# Altium project middlePCB_rev4.PrjPcb
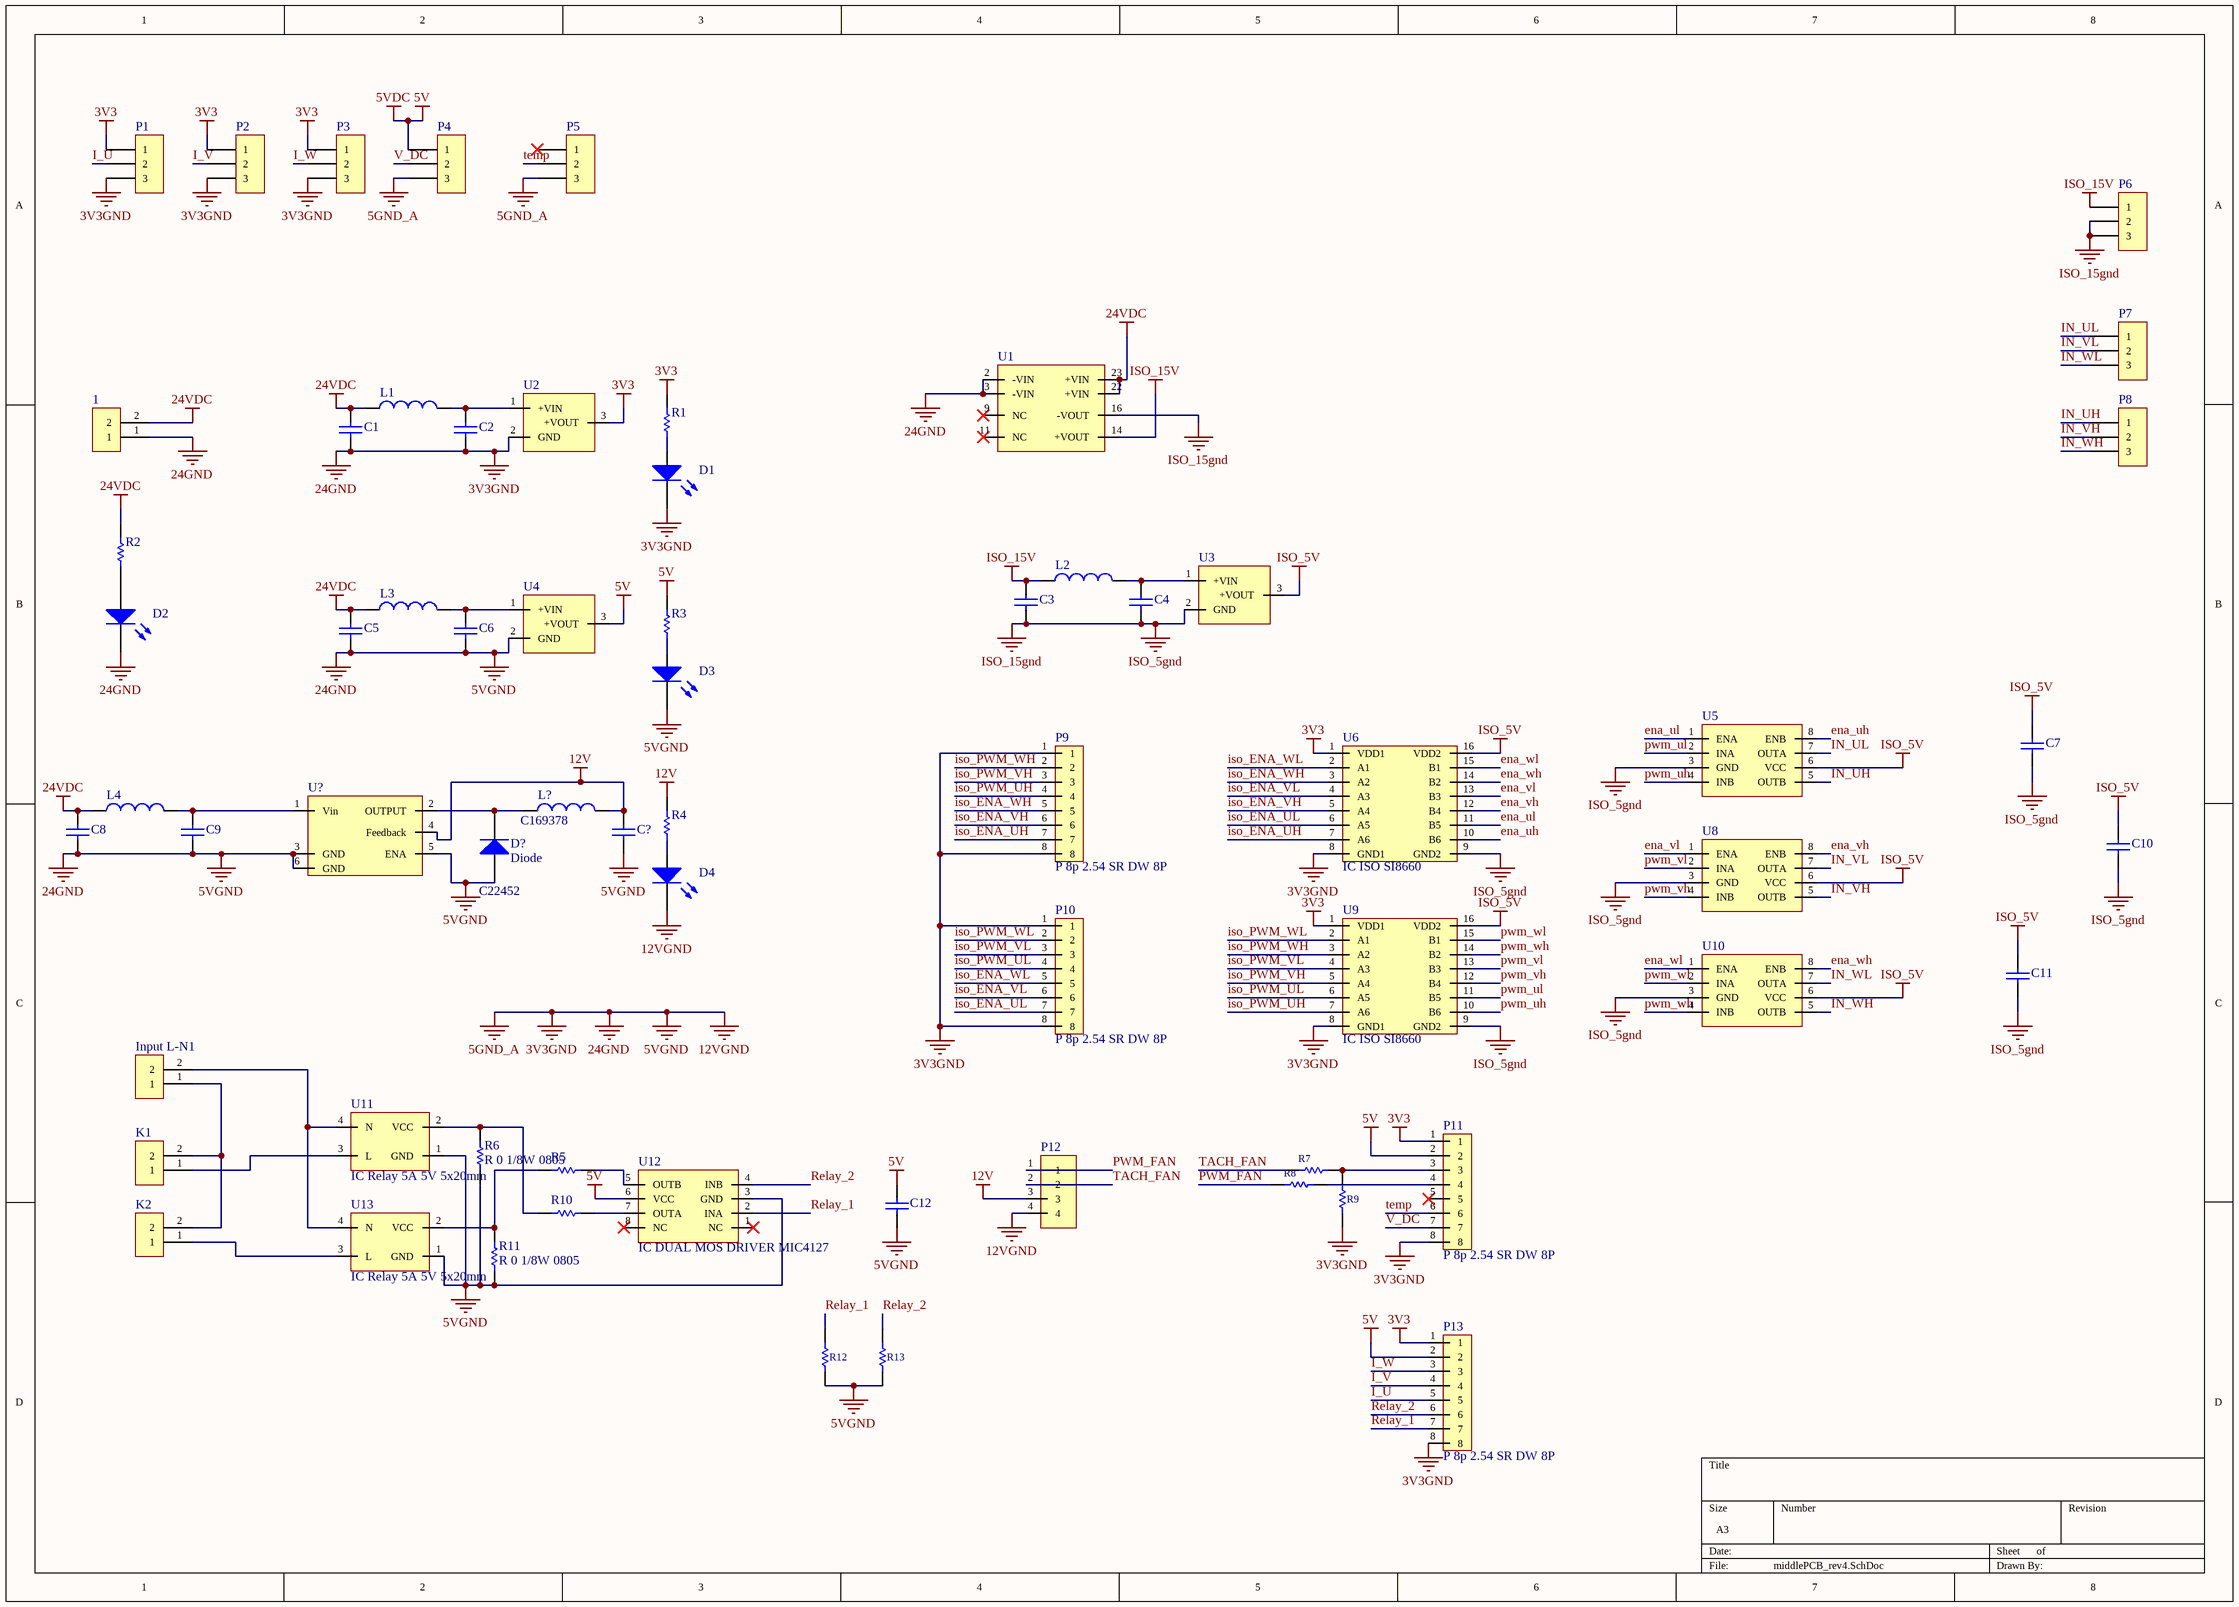
[diagram p0: middlePCB_rev4.SchDoc]
1 sheet, 66 parts. Net scope: global (net labels, ports and power ports of the same name join across sheets).
Board file: middlePCB_rev4.PcbDoc

## Sheet middlePCB_rev4.SchDoc
size A3

### Parts
1  P 2p 5mm  [connector1x2_parafuso]  (value not drawn)
C1  C 10uF 1206 MLCC 50V X5R  [CAPC_1206]  (value not drawn)
C2  C 10uF 1206 MLCC 50V X5R  [CAPC_1206]  (value not drawn)
C3  C 10uF 1206 MLCC 50V X5R  [CAPC_1206]  (value not drawn)
C4  C 10uF 1206 MLCC 50V X5R  [CAPC_1206]  (value not drawn)
C5  C 10uF 1206 MLCC 50V X5R  [CAPC_1206]  (value not drawn)
C6  C 10uF 1206 MLCC 50V X5R  [CAPC_1206]  (value not drawn)
C7  C 10uF 1206 MLCC 50V X5R  [CAPC_1206]  (value not drawn)
C8  C 10uF 1206 MLCC 50V X5R  [CAPC_1206]  (value not drawn)
C9  C 10uF 1206 MLCC 50V X5R  [CAPC_1206]  (value not drawn)
C10  C 10uF 1206 MLCC 50V X5R  [CAPC_1206]  (value not drawn)
C11  C 10uF 1206 MLCC 50V X5R  [CAPC_1206]  (value not drawn)
C12  C 10uF 1206 MLCC 50V X5R  [CAPC_1206]  (value not drawn)
C?  C 10uF 1206 MLCC 50V X5R  [CAPC_1206]  (value not drawn)
D1  IC LED 1206  [DIODE_1206]  (value not drawn)
D2  IC LED 1206  [DIODE_1206]  (value not drawn)
D3  IC LED 1206  [DIODE_1206]  (value not drawn)
D4  IC LED 1206  [DIODE_1206]  (value not drawn)
D?  Diode  LCSC PART #: C22452  [DIODE_1812]
Input_L-N1  P 2p 5mm  [connector1x2_parafuso]  (value not drawn)
K1  P 2p 5mm  [connector1x2_parafuso]  (value not drawn)
K2  P 2p 5mm  [connector1x2_parafuso]  (value not drawn)
L1  IND RLS-126  [Inductor - RLS-126]  (value not drawn)
L2  IND RLS-126  [Inductor - RLS-126]  (value not drawn)
L3  IND RLS-126  [Inductor - RLS-126]  (value not drawn)
L4  IND RLS-126  [Inductor - RLS-126]  (value not drawn)
L?  LCSC PART #: C169378  [IND_SWRB1207]  (hidden comment: IND 100uH 1.7A)
P1  P 8p 2.54 SR DW 3P  [MOLEX_3p_105431_1103]  (value not drawn)
P2  P 8p 2.54 SR DW 3P  [MOLEX_3p_105431_1103]  (value not drawn)
P3  P 8p 2.54 SR DW 3P  [MOLEX_3p_105431_1103]  (value not drawn)
P4  P 8p 2.54 SR DW 3P  [MOLEX_3p_105431_1103]  (value not drawn)
P5  P 8p 2.54 SR DW 3P  [MOLEX_3p_105431_1103]  (value not drawn)
P6  P 8p 2.54 SR DW 3P  [MOLEX_3p_105431_1103]  (value not drawn)
P7  P 8p 2.54 SR DW 3P  [MOLEX_3p_105431_1103]  (value not drawn)
P8  P 8p 2.54 SR DW 3P  [MOLEX_3p_105431_1103]  (value not drawn)
P9  P 8p 2.54 SR DW 8P  [Header 8x1 8.5mm]
P10  P 8p 2.54 SR DW 8P  [Header 8x1 8.5mm]
P11  P 8p 2.54 SR DW 8P  [Header 8x1 8.5mm]
P12  P 4p 2.54 MOL FAN  [HEADER 4p molex]  (value not drawn)
P13  P 8p 2.54 SR DW 8P  [Header 8x1 8.5mm]
R1  R 150 1/8W 0805 1%  [RESC_0805]  (value not drawn)
R2  R 2k7 1/8 0805 1%  [RESC_0805]  (value not drawn)
R3  R 330 1/8 0805 1%  [RESC_0805]  (value not drawn)
R4  R 1k2 1/8 0805 1%  [RESC_0805]  (value not drawn)
R5  R 10 1/8W 0805 1%  [RESC_0805]  (value not drawn)
R6  R 0 1/8W 0805  [RESC_0805]
R7  R 0 1/8W 0805  [RESC_0805]  (value not drawn)
R8  R 0 1/8W 0805  [RESC_0805]  (value not drawn)
R9  R 0 1/8W 0805  [RESC_0805]  (value not drawn)
R10  R 10 1/8W 0805 1%  [RESC_0805]  (value not drawn)
R11  R 0 1/8W 0805  [RESC_0805]
R12  R 0 1/8W 0805  [RESC_0805]  (value not drawn)
R13  R 0 1/8W 0805  [RESC_0805]  (value not drawn)
U1  IC DC/DC 15V ISO  [MeanWell SCWNo6]  (value not drawn)
U2  IC DC/DC 3V3  [DC/DC - R-78E3.3]  (value not drawn)
U3  IC DC/DC 5V  [DC/DC - OKI-78SR-E]  (value not drawn)
U4  IC DC/DC 5V  [DC/DC - OKI-78SR-E]  (value not drawn)
U5  IC Driver 5A Dual ENA IX4340  [SOIC-MIC4126]  (value not drawn)
U6  IC ISO SI8660  [SOIC127P610X155-16N]
U8  IC Driver 5A Dual ENA IX4340  [SOIC-MIC4126]  (value not drawn)
U9  IC ISO SI8660  [SOIC127P610X155-16N]
U10  IC Driver 5A Dual ENA IX4340  [SOIC-MIC4126]  (value not drawn)
U11  IC Relay 5A 5V 5x20mm  [Relay - G6DN]
U12  IC DUAL MOS DRIVER MIC4127  [SOIC-MIC4126]
U13  IC Relay 5A 5V 5x20mm  [Relay - G6DN]
U?  IC DC/C 12V  [XL2576]  (value not drawn)

### Nets
3V3: P1.1 P2.1 P3.1 P11.1 P13.1 R1.2 U2.3(+VOUT) U6.1(VDD1) U9.1(VDD1)
5V: C12.2 P4.1 P11.2 P13.2 R3.2 U4.3(+VOUT) U12.6(VCC)  [also labelled 5VDC]
12V: C?.2 L?.2 P12.3 R4.2 U?.4(Feedback)
12VGND: 1.1 C1.1 C2.1 C5.1 C6.1 C8.1 C9.1 C12.1 C?.1 D1.2(K) D2.2(K) D3.2(K) D4.2(K) D?.1(A) P1.3 P2.3 P3.3 P4.3 P5.3 P9.1 P9.8 P10.1 P10.8 P11.8 P12.4 P13.8 R6.2 R9.1 R11.2 R12.1 R13.1 U1.2(-VIN) U1.3(-VIN) U2.2(GND) U4.2(GND) U6.8(GND1) U9.8(GND1) U11.1(GND) U12.3(GND) U13.1(GND) U?.3(GND) U?.5(ENA) U?.6(GND)  [also labelled 24GND, 3V3GND, 5GND_A, 5VGND]
24VDC: 1.2 C1.2 C5.2 C8.2 L1.1 L3.1 L4.1 R2.2 U1.22(+VIN) U1.23(+VIN)
ISO_5V: C7.2 C10.2 C11.2 U3.3(+VOUT) U5.6(VCC) U6.16(VDD2) U8.6(VCC) U9.16(VDD2) U10.6(VCC)
ISO_15gnd: C3.1 C4.1 C7.1 C10.1 C11.1 P6.2 P6.3 U1.16(-VOUT) U3.2(GND) U5.3(GND) U6.9(GND2) U8.3(GND) U9.9(GND2) U10.3(GND)  [also labelled ISO_5gnd]
ISO_15V: C3.2 L2.1 P6.1 U1.14(+VOUT)
ena_uh: U5.8(ENB) U6.10(B6)
ena_ul: U5.1(ENA) U6.11(B5)
ena_vh: U6.12(B4) U8.8(ENB)
ena_vl: U6.13(B3) U8.1(ENA)
ena_wh: U6.14(B2) U10.8(ENB)
ena_wl: U6.15(B1) U10.1(ENA)
I_U: P1.2 P13.5
I_V: P2.2 P13.4
I_W: P3.2 P13.3
IN_UH: P8.1 U5.5(OUTB)
IN_UL: P7.1 U5.7(OUTA)
IN_VH: P8.2 U8.5(OUTB)
IN_VL: P7.2 U8.7(OUTA)
IN_WH: P8.3 U10.5(OUTB)
IN_WL: P7.3 U10.7(OUTA)
iso_ENA_UH: P9.7 U6.7(A6)
iso_ENA_UL: P10.7 U6.6(A5)
iso_ENA_VH: P9.6 U6.5(A4)
iso_ENA_VL: P10.6 U6.4(A3)
iso_ENA_WH: P9.5 U6.3(A2)
iso_ENA_WL: P10.5 U6.2(A1)
iso_PWM_UH: P9.4 U9.7(A6)
iso_PWM_UL: P10.4 U9.6(A5)
iso_PWM_VH: P9.3 U9.5(A4)
iso_PWM_VL: P10.3 U9.4(A3)
iso_PWM_WH: P9.2 U9.3(A2)
iso_PWM_WL: P10.2 U9.2(A1)
PWM_FAN: P12.1 R8.1
pwm_uh: U5.4(INB) U9.10(B6)
pwm_ul: U5.2(INA) U9.11(B5)
pwm_vh: U8.4(INB) U9.12(B4)
pwm_vl: U8.2(INA) U9.13(B3)
pwm_wh: U9.14(B2) U10.4(INB)
pwm_wl: U9.15(B1) U10.2(INA)
Relay_1: P13.7 R12.2 U12.2(INA)
Relay_2: P13.6 R13.2 U12.4(INB)
TACH_FAN: P12.2 R7.1
temp: P5.2 P11.6
V_DC: P4.2 P11.7
NetC2_2: C2.2 L1.2 U2.1(+VIN)
NetC4_2: C4.2 L2.2 U3.1(+VIN)
NetC6_2: C6.2 L3.2 U4.1(+VIN)
NetC9_2: C9.2 L4.2 U?.1(Vin)
NetD1_1: D1.1(A) R1.1
NetD2_1: D2.1(A) R2.1
NetD3_1: D3.1(A) R3.1
NetD4_1: D4.1(A) R4.1
NetD?_2: D?.2(K) L?.1 U?.2(OUTPUT)
NetInput_L-N1_1: Input_L-N1.1 K1.2 K2.2
NetInput_L-N1_2: Input_L-N1.2 U11.4(N) U13.4(N)
NetK1_1: K1.1 U11.3(L)
NetK2_1: K2.1 U13.3(L)
NetP11_3: P11.3 R7.2 R9.2
NetP11_4: P11.4 R8.2
NetR5_1: R5.1 U12.5(OUTB)
NetR5_2: R5.2 R11.1 U13.2(VCC)
NetR6_1: R6.1 R10.2 U11.2(VCC)
NetR10_1: R10.1 U12.7(OUTA)

Not connected (* = marked no-connect by the designer): P5 1*; P11 5*; U1 9(NC)* 11(NC)*; U12 1(NC)* 8(NC)*

### Library data of the parts
1 Input_L-N1 K1 K2 = gen_purpose_conn_1x2: Bloques de terminales de PCB de perfil estándar RS de 5,0 mm; RS VPN: 896-6696; Price: 0,24
C1-C12 C? = Capacitor SMD: Capacitores de cerâmica multicamada MLCC - SMD/SMT 1206 50V 10uF 20% X5R; Mouser VPN: 963-UMK316BBJ106ML-T; Price: 0,31; LCSC PART #: C13585
D1-D4 = LED: LEDs padrão - SMD GREEN WATER CLEAR; Mouser VPN: 604-APT3216SGC; Price: 0,387; LCSC PART #: C88326
D? = Diode: Default Diode
L1-L4 L? = Inductor: Indutores fixos Line Inductors for RECOM Power Supply
  L1-L4: Mouser VPN: 919-RLS-126; Price: 0,549
P1-P8 = Header 3: Distribuidores e Alojamento de Fios CGrid Hrd SRDW THo le 8ckt; Mouser VPN: 538-87937-0800; Price: 0,621
P9-P11 P13 = jumper_8p: Distribuidores e Alojamento de Fios CGrid Hrd SRDW THo le 8ckt; Mouser VPN: 538-87937-0800; Price: 0,621
P12 = Header 4p molex: Distribuidores e Alojamento de Fios 4 PIN HEADER WITH FR R WITH FRICTION LOCK; Mouser VPN: 538-47053-3000; Price: 0,405
R1 = Resistor: Resistores de Filme Espesso - SMD 1/8watt 150ohms 1% 100ppm; Mouser VPN: 71-CRCW0805-150-E3; Price: 0,09; LCSC PART #: C17471
R2 = Resistor: Resistores de Filme Espesso - SMD 1/8watt 2.7Kohms 1% 100ppm; Mouser VPN: 71-CRCW0805-2.7K-E3; Price: 0,09; LCSC PART #: C17530
R3 = Resistor: Resistores de Filme Espesso - SMD 1/8Watt 330ohms 1% Commercial Use; Mouser VPN: 71-CRCW0805330RFKEAC; Price: 0,09; LCSC PART #: C17630
R4 = Resistor: Resistores de Filme Espesso - SMD 1/8watt 1.2Kohms 1%; Mouser VPN: 71-CRCW08051K20FKEA; Price: 0,09; LCSC PART #: C17379
R5 R10 = Resistor: Resistores de Filme Espesso - SMD 1/8Watt 10ohms 1% Commercial Use; Mouser VPN: 71-CRCW080510R0FKEAC; Price: 0,09; LCSC PART #: C17415
R6-R9 R11-R13 = Resistor: Resistores de Filme Espesso - SMD 1/8Watt 0ohms Commercial Use; Mouser VPN: 71-CRCW08050000Z0EAC; Price: 0,09; LCSC PART #: C17477
U1 = MEANWELL - SCWN06: Conversores CC/CC com isolação 6W 18-36Vin 15Vout 400mA DIP24 Iso; Mouser VPN: 709-SCWN06B-15; Price: 8,26
U2 = DC/DC - R-78E3.3: Conversores CC/CC sem isolação 3.3V 500MA OUT THRU; Mouser VPN: 919-R-78E3.3-0.5; Price: 2,43
U3 U4 = DC/DC - R-78E3.3: Conversores CC/CC sem isolação 7-36Vin 5Vout 1.5A VSIP Encapsulated; Mouser VPN: 580-OK78SR5/1.5W36EC; Price: 5,31
U5 U8 U10 = Driver - IX4340: Drivers de portas Dual 5A Gate Driver IC; Equivalente: UCC27424DR; Mouser VPN: 747-IX4340NETR; Price: 0,891; LCSC PART #: C138519
U6 U9 = ISO SI8660: Isoladores digitais 1 kV 6-channel digital isolator; Mouser VPN: 634-SI8660BA-B-IS1; Price: 1,82
U11 U13 = Relay - G6DN: Relés para uso geral 1 form A w/ 5VDC Coil-standard type; Mouser VPN: 653-G6DN-1A-LDC5; Price: 1,59
U12 = MOS_DRIVER-MIC4126: Drivers de portas 1.5A Dual High Speed MOSFET Driver with Low Thermal Impedance; Equivalente: TC4427AEOA; Mouser VPN: 998-MIC4126YME; Price: 0,756; LCSC PART #: C20551
U? = XL2576: LCSC PART #: C73351